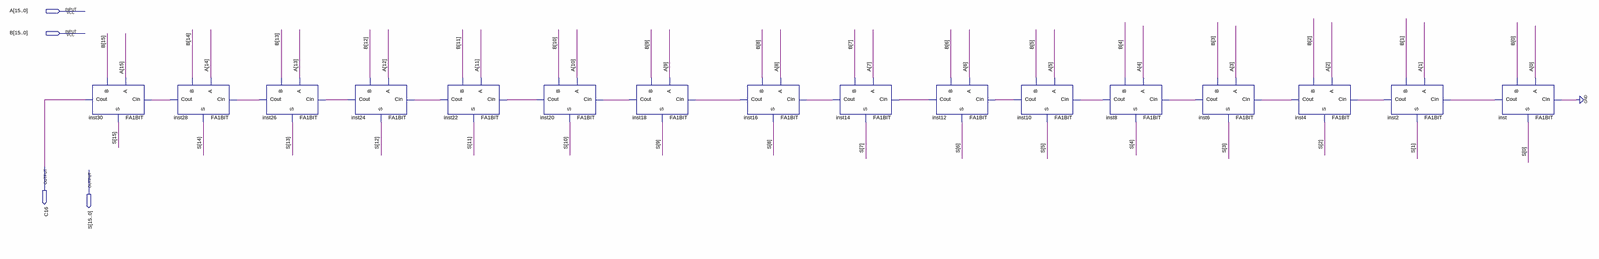
[diagram p0: schematic sheet, whole]
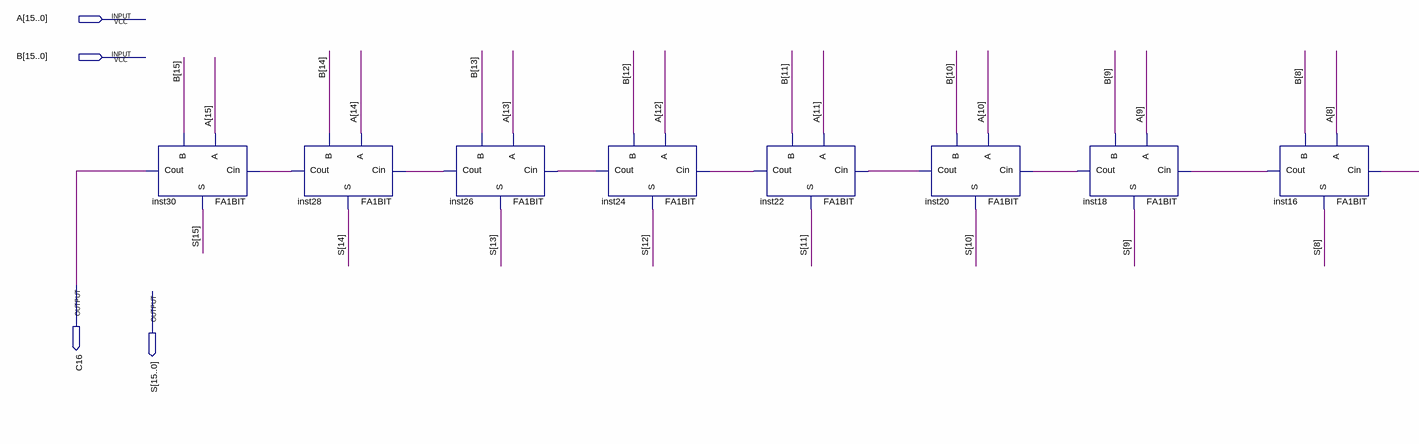
[diagram p1: schematic sheet, left part]
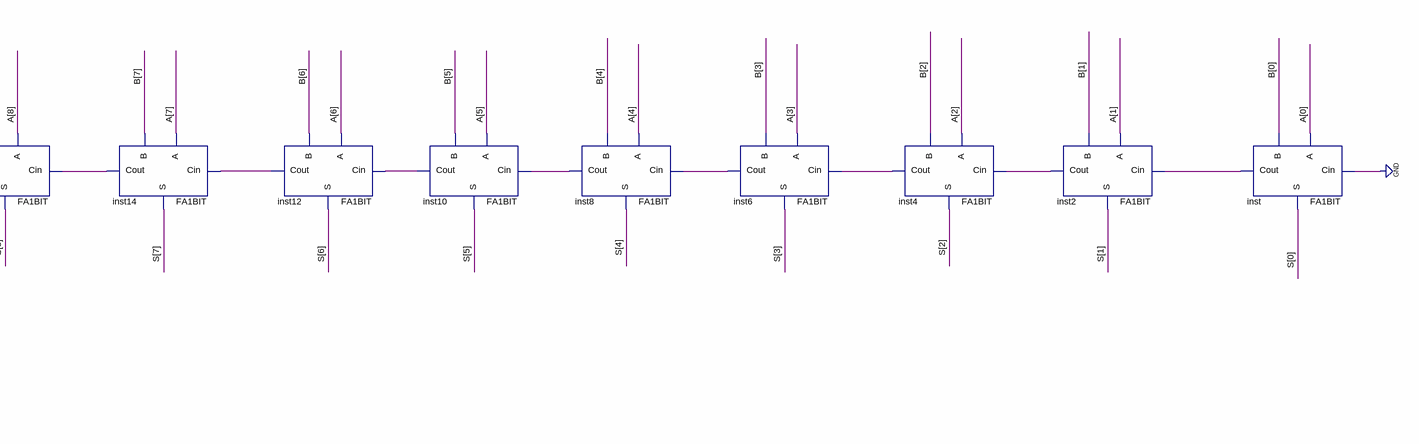
[diagram p2: schematic sheet, right part]
// Quartus schematic ADD16BIT.bdf as structural Verilog: 16 symbols, 4 pins
module ADD16BIT (
  input  [15:0] A,
  input  [15:0] B,
  output C16,
  output [15:0] S
);

  wire inst2_cout, inst4_cout, inst6_cout, inst8_cout, inst10_cout, inst12_cout, inst14_cout, inst16_cout,
       inst18_cout, inst20_cout, inst22_cout, inst24_cout, inst26_cout, inst28_cout, inst_cout;

  FA1BIT inst30 (.A(A[15]), .B(B[15]), .Cin(inst28_cout), .Cout(C16), .S(S[15]));
  FA1BIT inst28 (.A(A[14]), .B(B[14]), .Cin(inst26_cout), .Cout(inst28_cout), .S(S[14]));
  FA1BIT inst26 (.A(A[13]), .B(B[13]), .Cin(inst24_cout), .Cout(inst26_cout), .S(S[13]));
  FA1BIT inst24 (.A(A[12]), .B(B[12]), .Cin(inst22_cout), .Cout(inst24_cout), .S(S[12]));
  FA1BIT inst22 (.A(A[11]), .B(B[11]), .Cin(inst20_cout), .Cout(inst22_cout), .S(S[11]));
  FA1BIT inst20 (.A(A[10]), .B(B[10]), .Cin(inst18_cout), .Cout(inst20_cout), .S(S[10]));
  FA1BIT inst18 (.A(A[9]), .B(B[9]), .Cin(inst16_cout), .Cout(inst18_cout), .S(S[9]));
  FA1BIT inst16 (.A(A[8]), .B(B[8]), .Cin(inst14_cout), .Cout(inst16_cout), .S(S[8]));
  FA1BIT inst14 (.A(A[7]), .B(B[7]), .Cin(inst12_cout), .Cout(inst14_cout), .S(S[7]));
  FA1BIT inst12 (.A(A[6]), .B(B[6]), .Cin(inst10_cout), .Cout(inst12_cout), .S(S[6]));
  FA1BIT inst10 (.A(A[5]), .B(B[5]), .Cin(inst8_cout), .Cout(inst10_cout), .S(S[5]));
  FA1BIT inst8 (.A(A[4]), .B(B[4]), .Cin(inst6_cout), .Cout(inst8_cout), .S(S[4]));
  FA1BIT inst6 (.A(A[3]), .B(B[3]), .Cin(inst4_cout), .Cout(inst6_cout), .S(S[3]));
  FA1BIT inst4 (.A(A[2]), .B(B[2]), .Cin(inst2_cout), .Cout(inst4_cout), .S(S[2]));
  FA1BIT inst2 (.A(A[1]), .B(B[1]), .Cin(inst_cout), .Cout(inst2_cout), .S(S[1]));
  FA1BIT inst (.A(A[0]), .B(B[0]), .Cin(1'b0), .Cout(inst_cout), .S(S[0]));
endmodule
